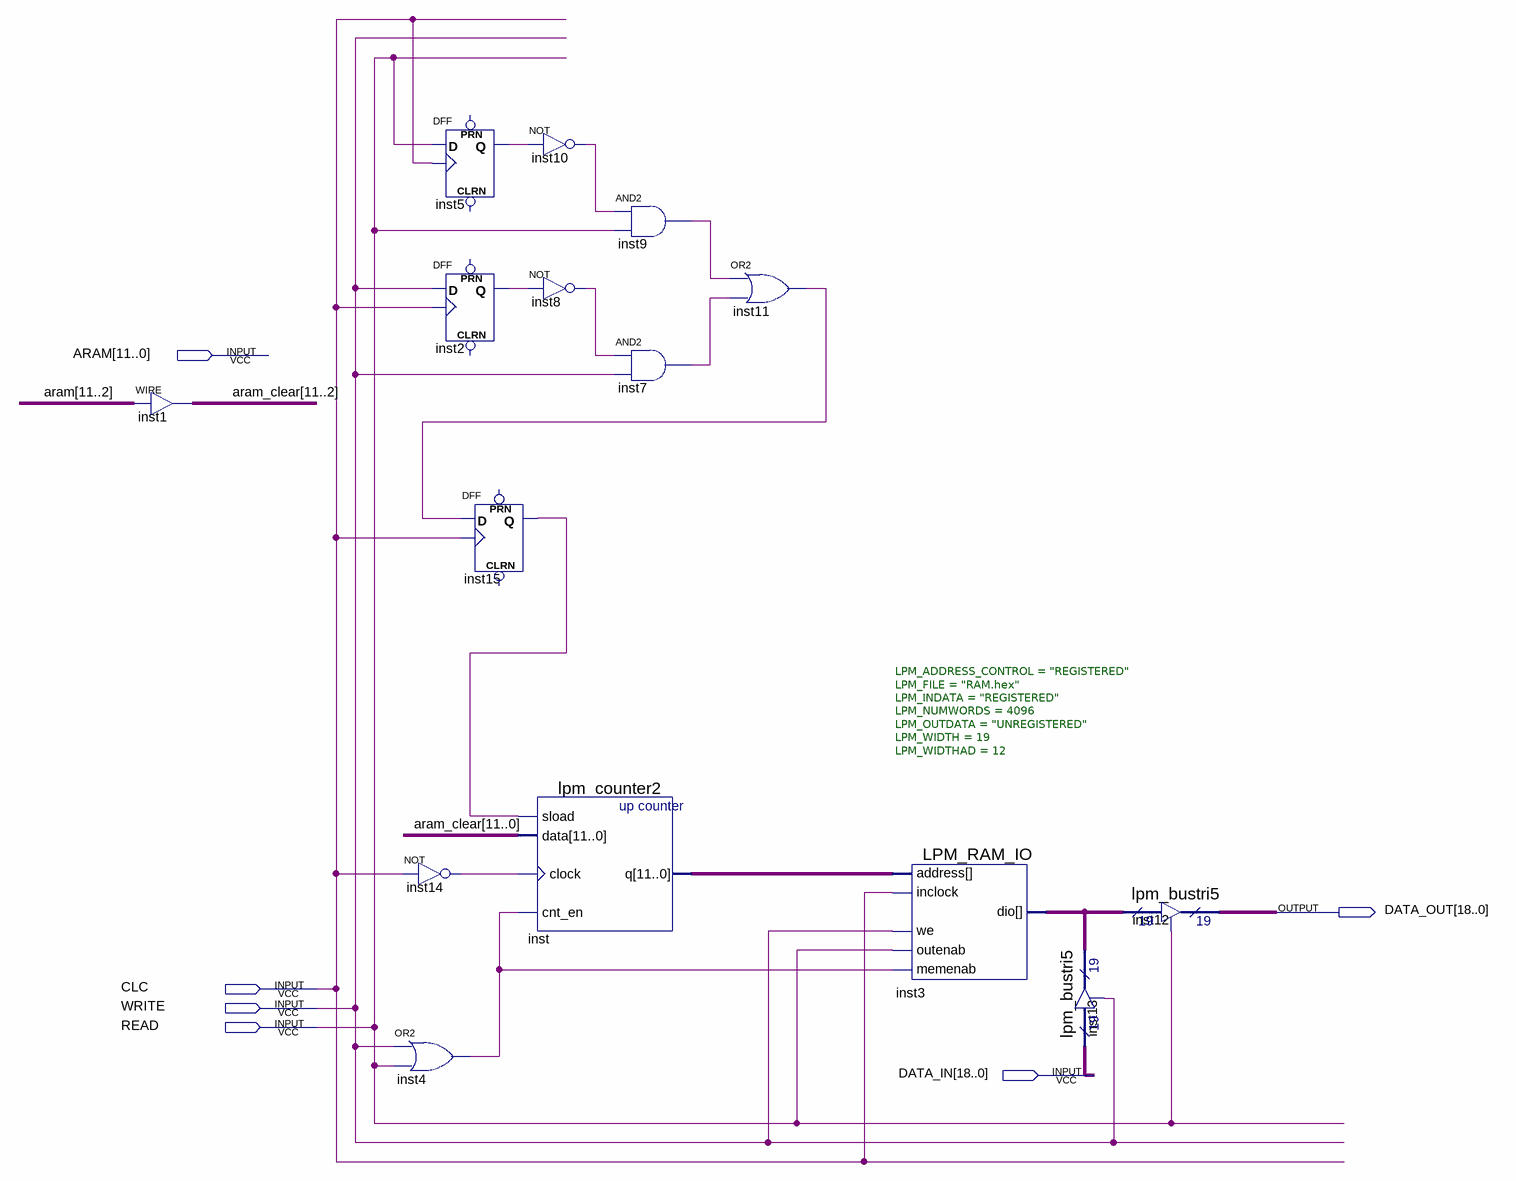
[diagram p0: schematic sheet]
// Quartus schematic MEM.bdf as structural Verilog: 15 symbols, 6 pins
module MEM (
  input  [11:0] ARAM,
  input  CLC,
  input  WRITE,
  input  READ,
  input  [18:0] DATA_IN,
  output [18:0] DATA_OUT
);

  wire inst2_q, inst4_out, inst5_q, inst7_out, inst8_out, inst9_out, inst10_out, inst11_out, inst14_out,
       inst15_q;
  wire [11:0] aram_clear, inst_q;
  wire [18:0] inst3_dio;

  assign aram_clear[11:2] = ARAM[11:2];  // WIRE inst1
  or inst4 (inst4_out, WRITE, READ);
  DFF inst5 (.CLK(CLC), .D(READ), .Q(inst5_q));  // open: CLRN, PRN
  DFF inst2 (.CLK(CLC), .D(WRITE), .Q(inst2_q));  // open: CLRN, PRN
  DFF inst15 (.CLK(CLC), .D(inst11_out), .Q(inst15_q));  // open: CLRN, PRN
  not inst14 (inst14_out, CLC);
  not inst10 (inst10_out, inst5_q);
  not inst8 (inst8_out, inst2_q);
  lpm_counter2 inst (.sload(inst15_q), .data(aram_clear), .clock(inst14_out), .cnt_en(inst4_out), .q(inst_q));
  and inst9 (inst9_out, inst10_out, READ);
  and inst7 (inst7_out, inst8_out, WRITE);
  or inst11 (inst11_out, inst9_out, inst7_out);
  LPM_RAM_IO #(.LPM_ADDRESS_CONTROL("REGISTERED"), .LPM_FILE("RAM.hex"), .LPM_INDATA("REGISTERED"), .LPM_NUMWORDS(4096), .LPM_OUTDATA("UNREGISTERED"), .LPM_WIDTH(19), .LPM_WIDTHAD(12)) inst3 (
    .address(inst_q), .memenab(inst4_out), .inclock(CLC), .we(WRITE), .outenab(READ), .dio(inst3_dio));
  lpm_bustri5 inst13 (.enabledt(WRITE), .data(DATA_IN), .tridata(inst3_dio));
  lpm_bustri5 inst12 (.enabledt(READ), .data(inst3_dio), .tridata(DATA_OUT));
endmodule
